# EAGLE design tuer-controller (EAGLE 6.5.0)
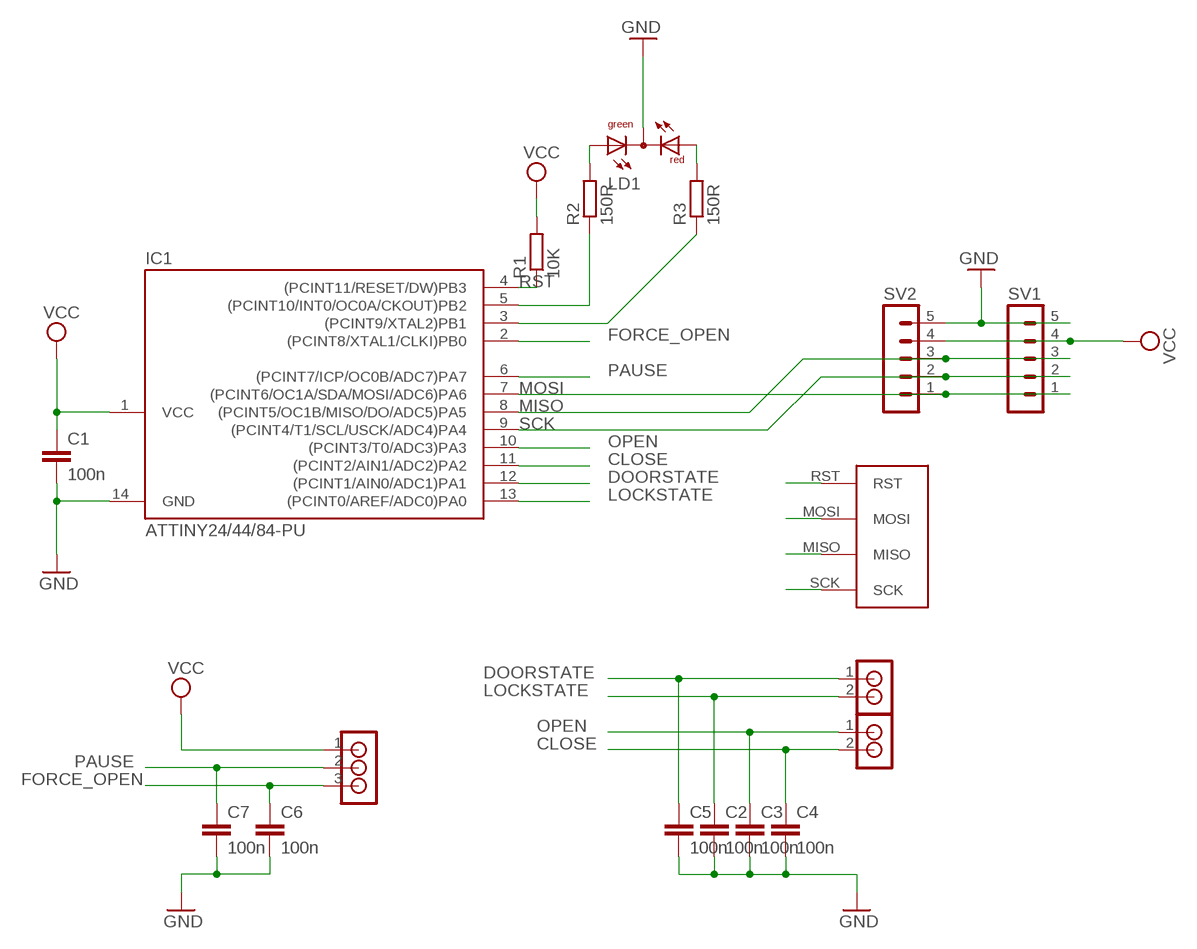
[diagram p0: schematic, sheet 1]

## Parts
C1  100n  C-EU025-024X044  [C025-024X044]
C2  100n  C-EU025-024X044  [C025-024X044]
C3  100n  C-EU025-024X044  [C025-024X044]
C4  100n  C-EU025-024X044  [C025-024X044]
C5  100n  C-EU025-024X044  [C025-024X044]
C6  100n  C-EU025-024X044  [C025-024X044]
C7  100n  C-EU025-024X044  [C025-024X044]
IC1  ATTINY24/44/84-PU  [DIL14]
LD1  DUOLED-RG-C  [DUOLED-C-5MM]
R1  10K  R-EU_0207/5V  [0207/5V]
R2  150R  R-EU_0207/10  [0207/10]
R3  150R  R-EU_0207/15  [0207/15]
SV1  MA05-1  [MA05-1]
SV2  MA05-1  [MA05-1]
U$1  AVR_ISP  [AVR_ISP]
U$2  RIACON_101_2  [RIACON_101_2]
U$3  RIACON_101_2  [RIACON_101_2]
U$5  RIACON_59_3  [RIACON_59_3]

## Nets
CLOSE: C4.1 IC1.11((PCINT2/AIN1/ADC2)PA2) U$3.2
DOORSTATE: C5.1 IC1.12((PCINT1/AIN0/ADC1)PA1) U$2.1
FORCE_OPEN: C6.1 IC1.2((PCINT8/XTAL1/CLKI)PB0) U$5.3
GND: C1.2 C2.2 C3.2 C4.2 C5.2 C6.2 C7.2 IC1.14(GND) LD1.C SV1.5 SV2.5
LOCKSTATE: C2.1 IC1.13((PCINT0/AREF/ADC0)PA0) U$2.2
MISO: IC1.8((PCINT5/OC1B/MISO/DO/ADC5)PA5) SV1.3 SV2.3 U$1.MISO
MOSI: IC1.7((PCINT6/OC1A/SDA/MOSI/ADC6)PA6) SV1.1 SV2.1 U$1.MOSI
N$1: IC1.5((PCINT10/INT0/OC0A/CKOUT)PB2) R2.1
N$2: IC1.3((PCINT9/XTAL2)PB1) R3.1
N$3: LD1.AX(AG) R2.2
N$4: LD1.AR R3.2
OPEN: C3.1 IC1.10((PCINT3/T0/ADC3)PA3) U$3.1
PAUSE: C7.1 IC1.6((PCINT7/ICP/OC0B/ADC7)PA7) U$5.2
RST: IC1.4((PCINT11/RESET/DW)PB3) R1.1 U$1.RST
SCK: IC1.9((PCINT4/T1/SCL/USCK/ADC4)PA4) SV1.2 SV2.2 U$1.SCK
VCC: C1.1 IC1.1(VCC) R1.2 SV1.4 SV2.4 U$5.1

## Power pins joined to a net without a drawn wire
GND: U$1.GND
VCC: U$1.VCC

## Library data of the parts
C1-C7 = resistor:C-EU: CAPACITOR, European symbol
IC1 = attiny24_44_84:ATTINY24/44/84
LD1 = led:DUOLED-RG-C: DUO LED 2 colors (red/green), 5 mm, round, common Cathode www.ligitek.com or other producers.
R1-R3 = resistor:R-EU_: RESISTOR, European symbol
SV1 SV2 = con-lstb:MA05-1: PIN HEADER; OC_FARNELL: unknown; OC_NEWARK: unknown
U$1 = n39:AVR_ISP: AVR ISP Pinheader Belegung: 1: MISO 2: VCC 3: SCK 4: MOSI 5: Reset 6: GND
U$2 U$3 = n39:RIACON_101_2: RIACON Anschlussklemme (AKL) Typ 101 Rastermaß 5,08 mm; REICHELT: AKL 101-02
U$5 = n39:RIACON_59_3: RIACON Anschlussklemme (AKL) Typ 59 Rastermaß 3,5 mm; REICHELT: AKL 059-03

## Board
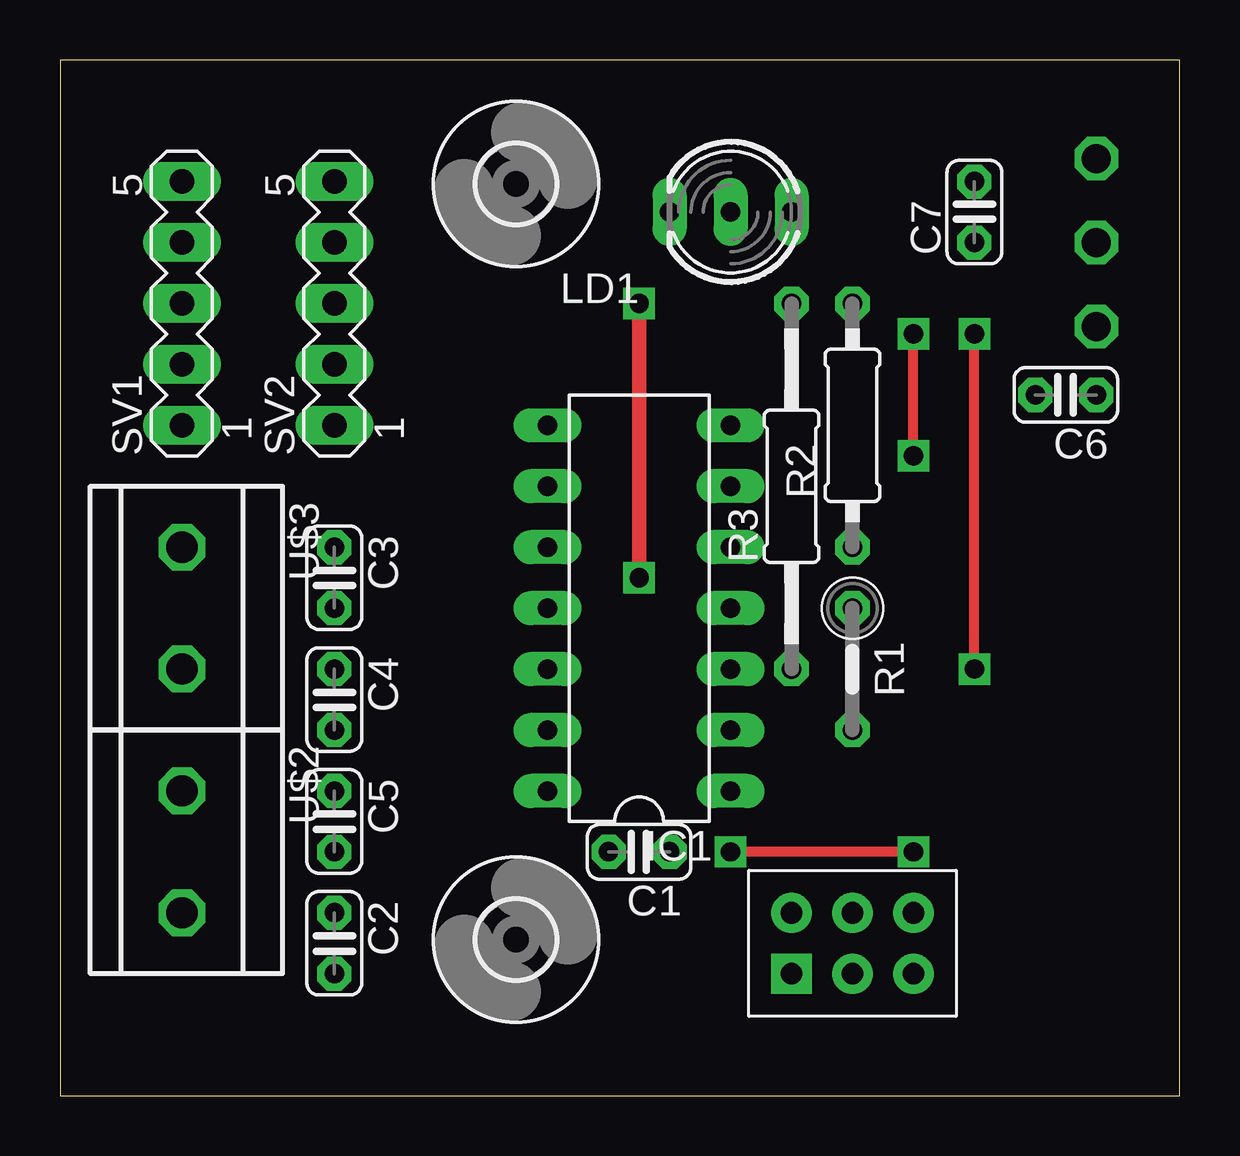
[diagram p1: board, top side]
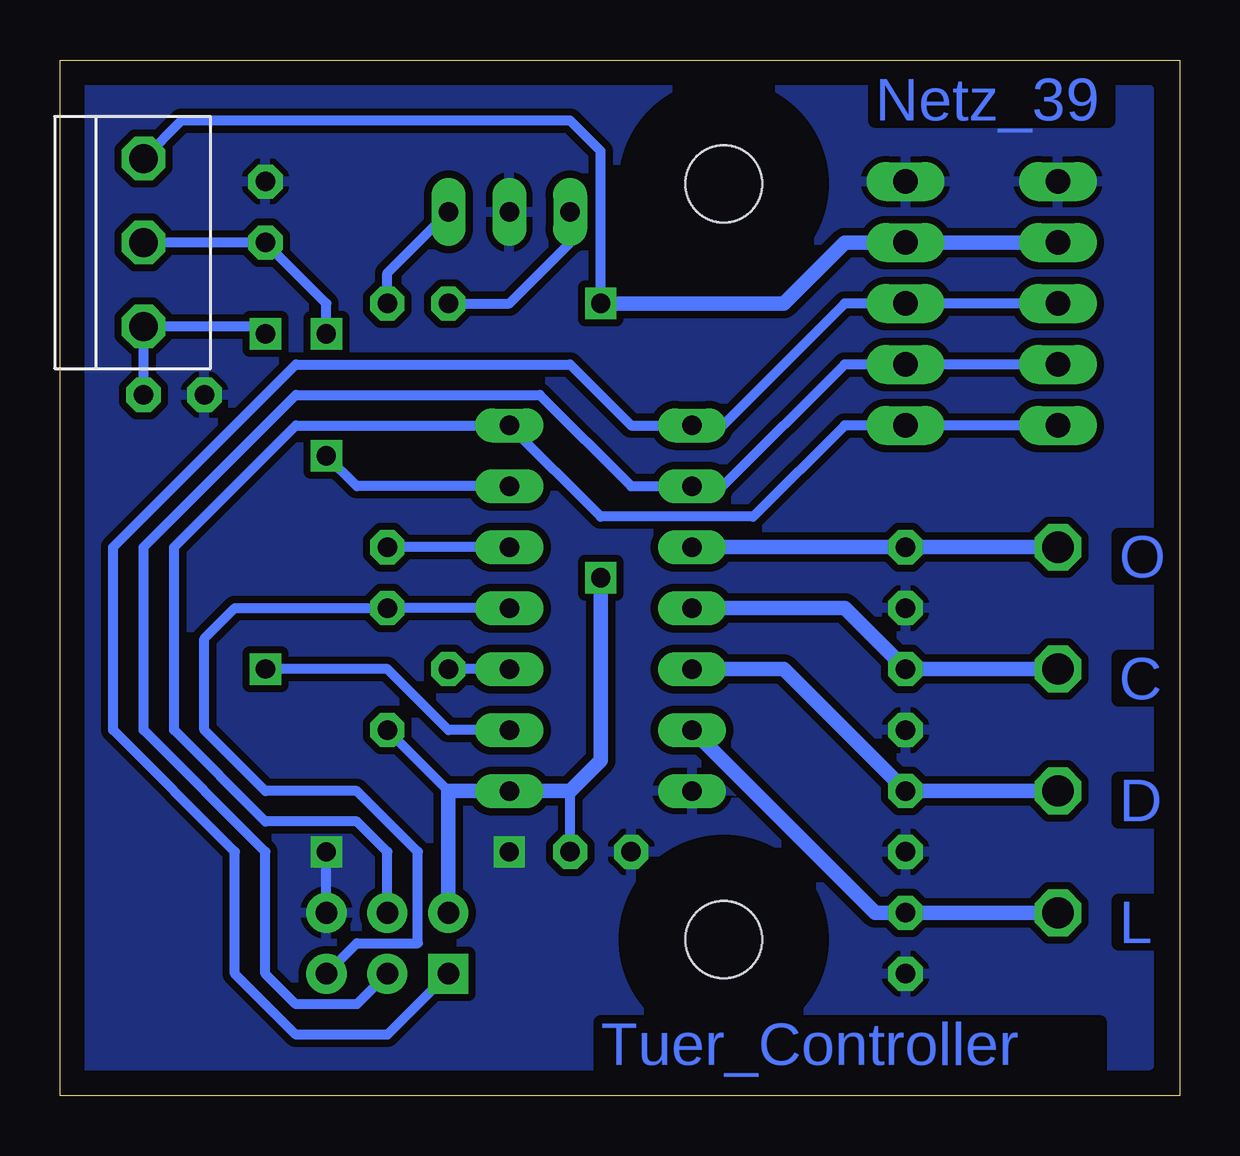
[diagram p2: board, bottom side, seen from below]

Size 46.66 x 43.17 mm. Coordinates in mm from the lower left corner, seen from the top.
Outline: 0,0 46.66,0 46.66,43.17 0,43.17 0,0
Copper layers (1*16): Top 0.035mm / dielectric 1.5mm / Bottom 0.035mm
Design rules "default *": minimum track width 12mil, minimum drill 24mil, track to track 8mil, track to pad 8mil, pad to pad 8mil, via to via 8mil, smd to smd 8mil, copper to edge 40mil, drill to drill 8mil, minimum pad ring 12mil, minimum via ring 10mil, stop-mask expansion 4mil, vias tented up to drill 0mil, thermal gap 10mil

### Footprints (pad centres in the part's own frame; a part is rotated, then mirrored left to right if it is on the bottom)
C025-024X044 = drill 0.813 octagon: 1 -1.27,0; 2 1.27,0
DIL14 = drill 0.813 long: 1 -7.62,-3.81; 2 -5.08,-3.81; 3 -2.54,-3.81; 4 0,-3.81; 5 2.54,-3.81; 6 5.08,-3.81; 7 7.62,-3.81; 8 7.62,3.81; 9 5.08,3.81; 10 2.54,3.81; 11 0,3.81; 12 -2.54,3.81; 13 -5.08,3.81; 14 -7.62,3.81
DUOLED-C-5MM = drill 0.813 long: AR 2.54,0; AX -2.54,0; C 0,0
0207/5V = drill 0.813 octagon: 1 -2.54,0; 2 2.54,0
0207/10 = drill 0.813 octagon: 1 -5.08,0; 2 5.08,0
0207/15 = drill 0.813 octagon: 1 -7.62,0; 2 7.62,0
MA05-1 = drill 1.016 long: 1 -5.08,0; 2 -2.54,0; 3 0,0; 4 2.54,0; 5 5.08,0
AVR_ISP = drill 0.9 pad 1.676: GND 1.27,-2.54; MOSI 1.27,0; RST -1.27,-2.54; SCK -1.27,0; VCC 1.27,2.54 | drill 0.9 pad 1.676 square: MISO -1.27,2.54
RIACON_101_2 = drill 1.3 octagon: 1 -2.54,0; 2 2.54,0
3,2 = hole 3.2: 0,0
RIACON_59_3 = drill 1.2 octagon: 1 -3.5,0; 2 0,0; 3 3.5,0

### Placement (x,y rotation side)
C1  24.13,10.16 180 top
C2  11.43,6.35 270 top
C3  11.43,21.59 270 top
C4  11.43,16.51 270 top
C5  11.43,11.43 270 top
C6  41.91,29.21 180 top
C7  38.1,36.83 90 top
IC1  24.13,20.32 90 top
LD1  27.94,36.83 180 top
R1  33.02,17.78 270 top
R2  33.02,27.94 90 top
R3  30.48,25.4 90 top
SV1  5.08,33.02 90 top
SV2  11.43,33.02 90 top
U$1  33.02,6.35 90 top
U$2  5.08,10.16 270 top
U$3  5.08,20.32 270 top
U$4  [3,2]  19,38 0 top
U$5  43.18,35.56 270 bottom
U$6  [3,2]  19,6.5 0 top

### Tracks (layer width: path | path; a pad name or v marks a point on that pad's centre or on a via)
CLOSE
  Bottom 0.61: U$3.2 C4.1 13.97,20.32 IC1.11
DOORSTATE
  Bottom 0.406: IC1.12 19.05,17.78
  Bottom 0.61: U$2.1 C5.1 16.51,17.78 IC1.12
FORCE_OPEN  (via drill 0.8)
  Top 0.406: v38.1,17.78 v38.1,31.75
  Bottom 0.406: IC1.2 30.48,15.24 33.02,17.78 v38.1,17.78 | v38.1,31.75 38.41,32.06 U$5.3 C6.1
GND  (via drill 0.8)
  Top 0.406: v35.56,10.16 v27.94,10.16
  Bottom 0.406: U$1.GND v35.56,10.16
  pour Bottom (isolate 0.305): 1.27,41.91 45.72,41.91 45.72,1.27 1.27,1.27
LOCKSTATE
  Bottom 0.61: U$2.2 C2.1 12.7,7.62 IC1.13
MISO
  Bottom 0.406: U$1.MISO 33.02,2.54 36.83,2.54 39.37,5.08 39.37,10.16 44.45,15.24 44.45,22.86 36.83,30.48 25.4,30.48 22.86,27.94 IC1.8 19.05,27.94 13.97,33.02 SV2.3 SV1.3
MOSI
  Bottom 0.406: U$1.MOSI 33.02,10.16 34.29,11.43 38.1,11.43 41.91,15.24 41.91,22.86 36.83,27.94 IC1.7 24.13,24.13 17.78,24.13 13.97,27.94 SV2.1 SV1.1
N$1
  Bottom 0.406: IC1.5 R2.1
N$2
  Bottom 0.406: IC1.3 R3.1
N$3
  Bottom 0.406: R2.2 33.02,34.29 LD1.AX
N$4
  Bottom 0.406: R3.2 27.94,33.02 25.4,35.56 LD1.AR
OPEN
  Bottom 0.61: U$3.1 C3.1 IC1.10
PAUSE  (via drill 0.8)
  Top 0.406: v35.56,26.67 v35.56,31.75
  Bottom 0.406: IC1.6 34.29,25.4 v35.56,26.67 | U$5.2 C7.1 35.56,33.02 v35.56,31.75
RST
  Bottom 0.406: IC1.4 R1.1 39.37,20.32 40.64,19.05 40.64,15.24 38.1,12.7 34.29,12.7 31.75,10.16 31.75,6.35 34.29,6.35 U$1.RST
SCK
  Bottom 0.406: U$1.SCK 34.29,3.81 36.83,3.81 38.1,5.08 38.1,10.16 43.18,15.24 43.18,22.86 36.83,29.21 26.67,29.21 22.86,25.4 IC1.9 19.05,25.4 13.97,30.48 SV2.2 SV1.2
VCC  (via drill 0.8)
  Top 0.61: v24.13,21.59 v24.13,33.02
  Bottom 0.406: C1.1 25.4,12.7 | 30.48,12.7 R1.2 | v24.13,33.02 24.13,39.37 25.4,40.64 41.6,40.64 U$5.1
  Bottom 0.61: U$1.VCC 30.48,12.7 IC1.1 25.4,12.7 24.13,13.97 v24.13,21.59 | v24.13,33.02 16.51,33.02 13.97,35.56 SV2.4 SV1.4

### Text on the board
Bottom: Netz_39 | O | C | D | L | Tuer_Controller